# EAGLE design pixpi (EAGLE 9.1.0)

## Sheet 1 of 2: fuse
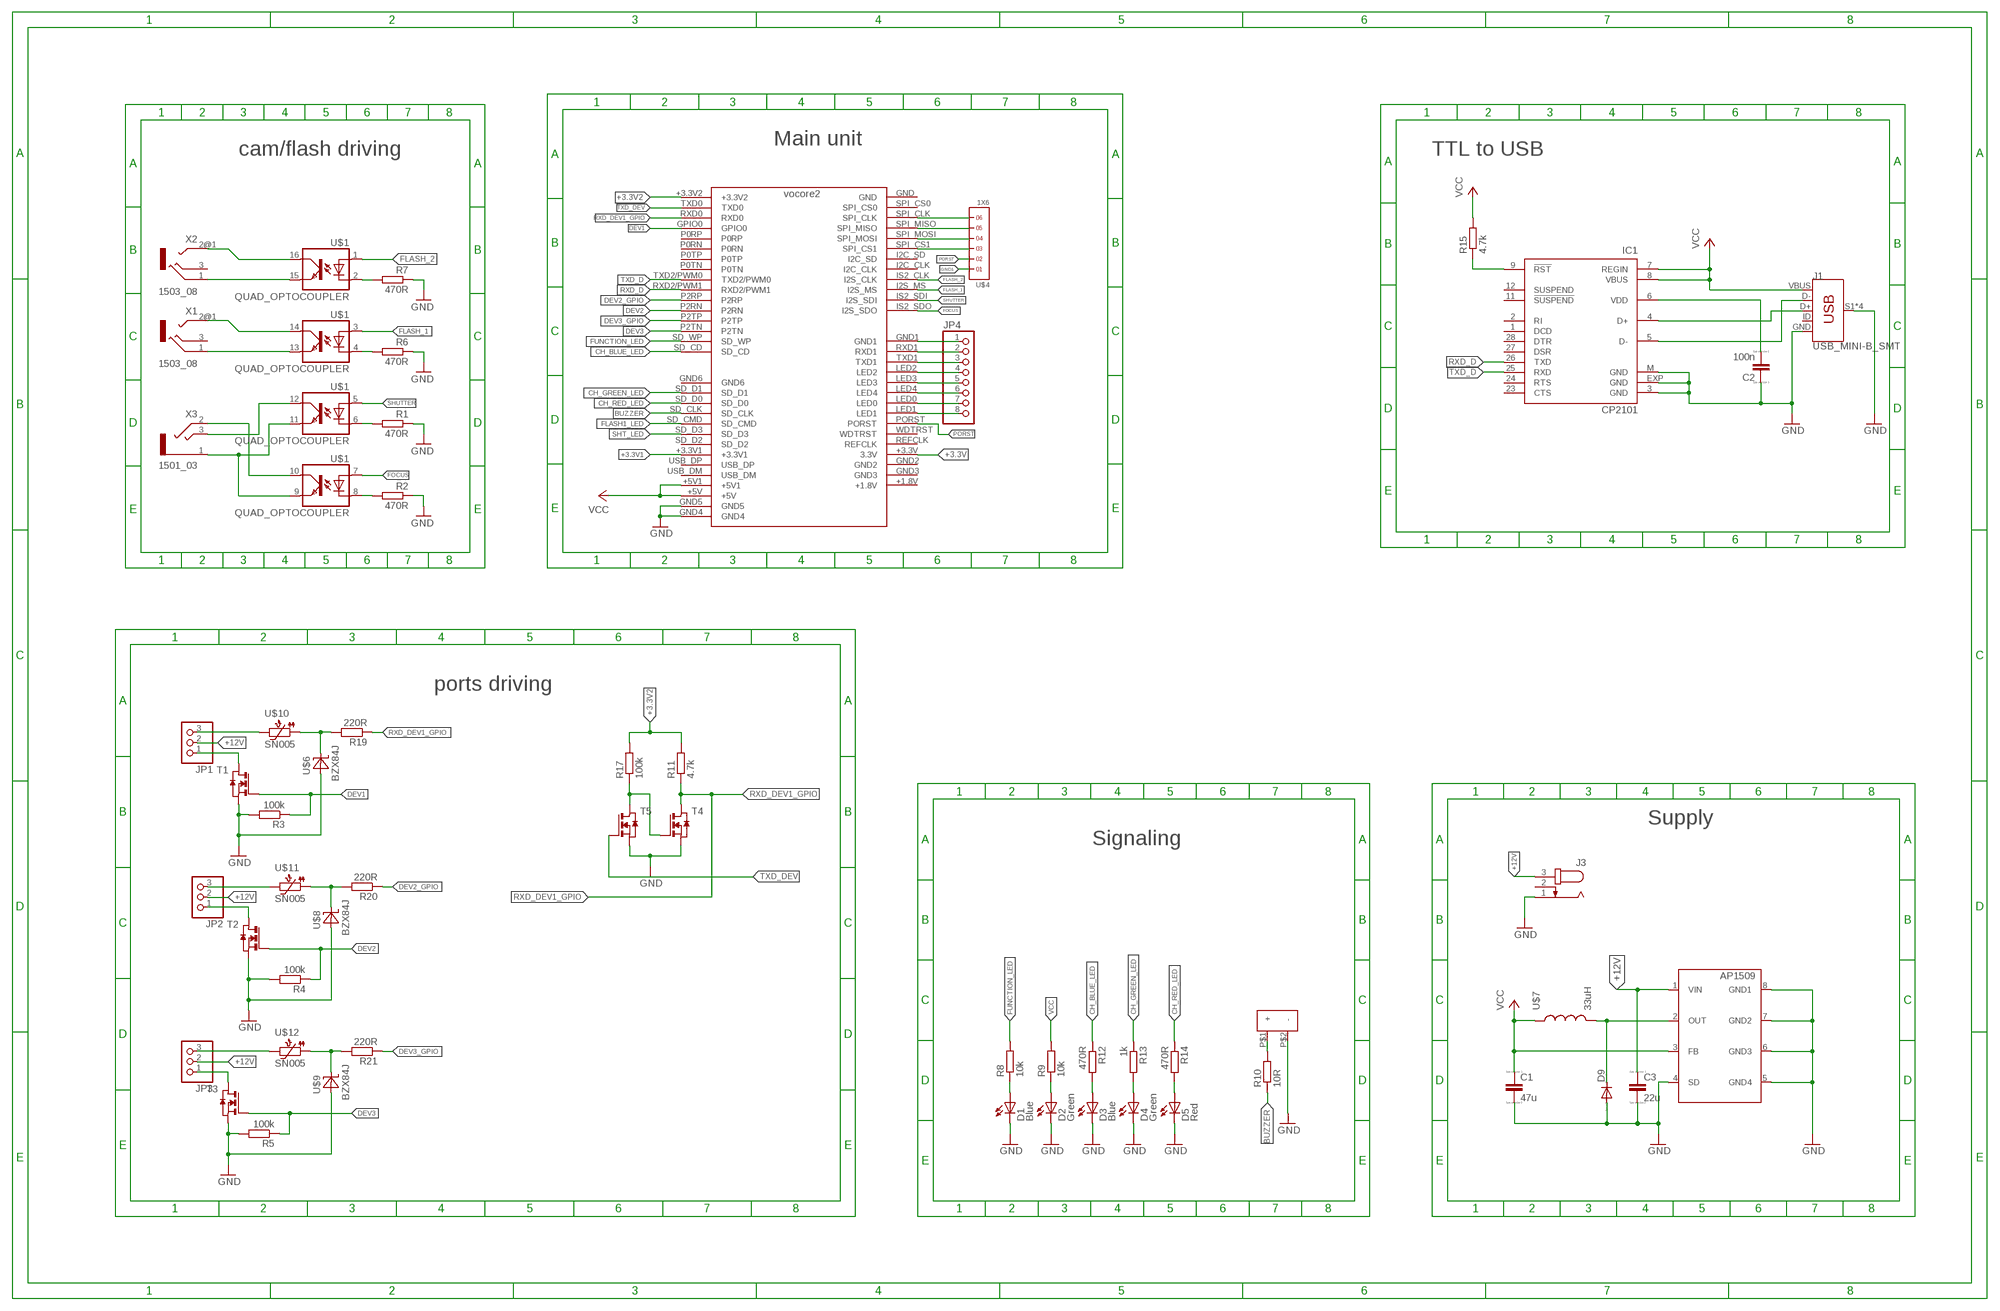
[diagram p0: schematic, sheet 1]

### Parts
C1  47u  CC1210  [C1210]
C2  100n  C  [C0805]
C3  22u  CC1210  [C1210]
D1  Blue  LEDCHIPLED_0603  [CHIPLED_0603]
D2  Green  LEDCHIPLED_0603  [CHIPLED_0603]
D3  Blue  LEDCHIPLED_1206  [CHIPLED_1206]
D4  Green  LEDCHIPLED_1206  [CHIPLED_1206]
D5  Red  LEDCHIPLED_1206  [CHIPLED_1206]
D9  DIODE-SOD323-W  [SOD323-W]
IC1  CP2101  [MLP28]
J1  USB_MINI-B_SMT  [USB-MINIB]
J3  JACK-PLUG0  [SPC4077]
JP1  PINHD-1X3/90  [1X03/90]
JP2  PINHD-1X3/90  [1X03/90]
JP3  PINHD-1X3/90  [1X03/90]
JP4  PINHD-1X8  [1X08]
R1  470R  R-EU_R0805  [R0805]
R2  470R  R-EU_R0805  [R0805]
R3  100k  R-EU_R0805  [R0805]
R4  100k  R-EU_R0805  [R0805]
R5  100k  R-EU_R0805  [R0805]
R6  470R  R-EU_R0805  [R0805]
R7  470R  R-EU_R0805  [R0805]
R8  10k  R-EU_R0805  [R0805]
R9  10k  R-EU_R0805  [R0805]
R10  10R  R-EU_R0805  [R0805]
R11  4.7k  R-EU_R0805  [R0805]
R12  470R  R-EU_R0805  [R0805]
R13  1k  R-EU_R0805  [R0805]
R14  470R  R-EU_R0805  [R0805]
R15  4.7k  R-EU_R0805  [R0805]
R17  100k  R-EU_R0805  [R0805]
R19  220R  R-EU_R0805  [R0805]
R20  220R  R-EU_R0805  [R0805]
R21  220R  R-EU_R0805  [R0805]
T1  NMOSSOT23  [SOT-23]
T2  NMOSSOT23  [SOT-23]
T3  NMOSSOT23  [SOT-23]
T4  NMOSSOT23  [SOT-23]
T5  NMOSSOT23  [SOT-23]
U$1  QUAD_OPTOCOUPLER  [SO16]
U$2  VOCORE2  [VOCORE2]
U$3  LD-BZEG-0905  [LD-BZEG-0905]
U$4  1X6  [1X6]
U$5  AP1509  [SOP08]
U$6  BZX84J  [SOD323_ST]
U$7  33uH  DJNR6028  [DJNR6028]
U$8  BZX84J  [SOD323_ST]
U$9  BZX84J  [SOD323_ST]
U$10  SN005  [R1206]
U$11  SN005  [R1206]
U$12  SN005  [R1206]
X1  1503_08  [1503_08]
X2  1503_08  [1503_08]
X3  1501_03  [1501_03]

### Nets
+3.3V: U$2.+3.3V(3.3V)
+3.3V1: U$2.+3.3V1
+3.3V2: R11.2 R17.2 U$2.+3.3V2
+12V: C3.1 J3.3 JP1.2 JP2.2 JP3.2 U$5.1(VIN)
BUZZER: R10.1 U$2.SD_CLK
CH_BLUE_LED: R12.1 U$2.SD_CD
CH_GREEN_LED: R13.1 U$2.SD_D1
CH_RED_LED: R14.1 U$2.SD_D0
DEV1: R3.1 T1.3(G) U$2.GPIO0
DEV2: R4.1 T2.3(G) U$2.P2RN
DEV2_GPIO: R20.1 U$2.P2RP
DEV3: R5.1 T3.3(G) U$2.P2TN
DEV3_GPIO: R21.1 U$2.P2TP
FLASH1_LED: U$2.SD_CMD
FLASH_1: U$1.3(A1) U$2.I2S_MS
FLASH_2: U$1.1(A) U$2.IS2_CLK(I2S_CLK)
FOCUS: U$1.7(A3) U$2.IS2_SDO(I2S_SDO)
FUNCTION_LED: R8.2 U$2.SD_WP
GND: C1.2 C2.1 C3.2 D1.C D2.C D3.C D4.C D5.C D9.A IC1.3(GND) IC1.EXP(GND) IC1.M(GND) J1.GND J1.S1(SHIELD) J1.S2(SHIELD) J1.S3(SHIELD) J1.S4(SHIELD) J3.1 R1.1 R2.1 R3.2 R4.2 R5.2 R6.1 R7.1 T1.2(S) T2.2(S) T3.2(S) T4.2(S) T5.2(S) U$2.GND4 U$2.GND5 U$3.P$2(-) U$5.4(SD) U$5.5(GND4) U$5.6(GND3) U$5.7(GND2) U$5.8(GND1) U$6.A U$8.A U$9.A
GND1: JP4.1 U$2.GND1 U$4.1
N$1: JP2.1 T2.1(D)
N$2: R19.2 U$6.C U$10.1
N$3: D9.C U$5.2(OUT) U$7.P$4
N$4: U$1.13(EMIT1) X1.1
N$5: U$1.10(COL3) X3.2
N$6: JP1.3 U$10.2
N$7: R6.2 U$1.4(C1)
N$8: JP3.1 T3.1(D)
N$9: R21.2 U$9.C U$12.1
N$10: U$1.12(COL2) X3.3
N$11: U$1.9(EMIT3) U$1.11(EMIT2) X3.1
N$12: R1.2 U$1.6(C2)
N$13: R10.2 U$3.P$1(+)
N$14: R2.2 U$1.8(C3)
N$15: JP2.3 U$11.2
N$16: U$1.14(COL1) X1.2@1
N$17: JP3.3 U$12.2
N$18: D2.A R9.1
N$19: D1.A R8.1
N$20: R20.2 U$8.C U$11.1
N$21: JP1.1 T1.1(D)
N$22: IC1.9(!RST) R15.1
N$23: U$2.SPI_CS1 U$4.3
N$24: IC1.5(D-) J1.D-
N$25: IC1.4(D+) J1.D+
N$26: C2.2 IC1.6(VDD)
N$27: U$2.SPI_MOSI U$4.4
N$28: U$2.SPI_MISO U$4.5
N$29: U$2.SPI_CLK U$4.6
N$35: R17.1 T4.3(G) T5.1(D)
N$43: D3.A R12.2
N$44: D4.A R13.2
N$45: U$1.15(EMIT) X2.1
N$46: U$1.16(COL) X2.2@1
N$47: D5.A R14.2
N$48: R7.2 U$1.2(C)
N$53: JP4.2 U$2.RXD1
N$54: JP4.3 U$2.TXD1
N$55: JP4.4 U$2.LED2
N$56: JP4.5 U$2.LED3
N$57: JP4.6 U$2.LED4
N$58: JP4.7 U$2.LED0
N$59: JP4.8 U$2.LED1
PORST: U$2.PORST U$4.2
RXD_D: IC1.26(TXD) U$2.RXD2/PWM1
RXD_DEV1_GPIO: R11.1 R19.1 T4.1(D) U$2.RXD0
SHT_LED: U$2.SD_D3
SHUTTER: U$1.5(A2) U$2.IS2_SDI(I2S_SDI)
TXD_D: IC1.25(RXD) U$2.TXD2/PWM0
TXD_DEV: T5.3(G) U$2.TXD0
VCC: C1.1 IC1.7(REGIN) IC1.8(VBUS) J1.VBUS R9.2 R15.2 U$2.+5V U$2.+5V1 U$5.3(FB) U$7.P$3
Unconnected: IC1.1(DCD) IC1.2(RI) IC1.11(!SUSPEND) IC1.12(SUSPEND) IC1.23(CTS) IC1.24(RTS) IC1.27(DSR) IC1.28(DTR) J1.ID J3.2 U$2.+1.8V U$2.GND U$2.GND2 U$2.GND3 U$2.GND6 U$2.I2C_CLK U$2.I2C_SD U$2.P0RN U$2.P0RP U$2.P0TN U$2.P0TP U$2.REFCLK U$2.SD_D2 U$2.SPI_CS0 U$2.USB_DM U$2.USB_DP U$2.WDTRST X1.2@2 X1.3 X2.2@2 X2.3

### Notes on the sheet
- Main unit
- cam/flash driving | TTL to USB
- ports driving
- Supply
- Signaling

## Sheet 2 of 2

## Library data of the parts
C1-C3 = eagle-ltspice:C: CAPACITOR, European symbol; SPICEMODEL: NONE; SPICEPREFIX: C
D1 = led:LED: LED OSRAM: - CHIPLED LG R971, LG N971, LY N971, LG Q971, LY Q971, LO R971, LY R971 LH N974, LH R974 LS Q976, LO Q976, LY Q976 LO Q996 - Hyper CHIPLED LW Q18S LB Q993, LB Q99A, LB R99A - SideLED LS A670, LO A670, LY A670, LG A670, LP A670 LB A673, LV A673, LT A673, LW A673 LH A674 LY A675 LS A676, LA A676, LO A676, LY A676, LW A676 LS A679, LY A679, LG A679 - Hyper Micro SIDELED® LS Y876, LA Y876, LO Y876, LY Y876 LT Y87S - SmartLED LW L88C, LW L88S LB L89C, LB L89S, LG L890 LS L89K, LO L89K, LY L89K LS L896, LA L896, LO L896, LY L896 - TOPLED LS T670, LO T670, LY T670, LG T670, LP T670 LSG T670, LSP T670, LSY T670, LOP T670, LYG T670 LG T671, LOG T671, LSG T671 LB T673, LV T673, LT T673, LW T673 LH T674 LS T676, LA T676, LO T676, LY T676, LB T676, LH T676, LSB T676, LW T676 LB T67C, LV T67C, LT T67C, LS T67K, LO T67K, LY T67K, LW E67C LS E67B, LA E67B, LO E67B, LY E67B, LB E67C, LV E67C, LT E67C LW T67C LS T679, LY T679, LG T679 LS T770, LO T770, LY T770, LG T770, LP T770 LB T773, LV T773, LT T773, LW T773 LH T774 LS E675, LA E675, LY E675, LS T675 LS T776, LA T776, LO T776, LY T776, LB T776 LHGB T686 LT T68C, LB T68C - Hyper Mini TOPLED® LB M676 - Mini TOPLED Santana® LG M470 LS M47K, LO M47K, LY M47K Source: http://www.osram.convergy.de LUXEON: - LUMILED® LXK2-PW12-R00, LXK2-PW12-S00, LXK2-PW14-U00, LXK2-PW14-V00 LXK2-PM12-R00, LXK2-PM12-S00, LXK2-PM14-U00 LXK2-PE12-Q00, LXK2-PE12-R00, LXK2-PE12-S00, LXK2-PE14-T00, LXK2-PE14-U00 LXK2-PB12-K00, LXK2-PB12-L00, LXK2-PB12-M00, LXK2-PB14-N00, LXK2-PB14-P00, LXK2-PB14-Q00 LXK2-PR12-L00, LXK2-PR12-M00, LXK2-PR14-Q00, LXK2-PR14-R00 LXK2-PD12-Q00, LXK2-PD12-R00, LXK2-PD12-S00 LXK2-PH12-R00, LXK2-PH12-S00 LXK2-PL12-P00, LXK2-PL12-Q00, LXK2-PL12-R00 Source: www.luxeon.com KINGBRIGHT: KA-3528ASYC Source: www.kingbright.com; SPICEPREFIX: D; TME: FYLS-0603UBC
D2 = led:LED: LED OSRAM: - CHIPLED LG R971, LG N971, LY N971, LG Q971, LY Q971, LO R971, LY R971 LH N974, LH R974 LS Q976, LO Q976, LY Q976 LO Q996 - Hyper CHIPLED LW Q18S LB Q993, LB Q99A, LB R99A - SideLED LS A670, LO A670, LY A670, LG A670, LP A670 LB A673, LV A673, LT A673, LW A673 LH A674 LY A675 LS A676, LA A676, LO A676, LY A676, LW A676 LS A679, LY A679, LG A679 - Hyper Micro SIDELED® LS Y876, LA Y876, LO Y876, LY Y876 LT Y87S - SmartLED LW L88C, LW L88S LB L89C, LB L89S, LG L890 LS L89K, LO L89K, LY L89K LS L896, LA L896, LO L896, LY L896 - TOPLED LS T670, LO T670, LY T670, LG T670, LP T670 LSG T670, LSP T670, LSY T670, LOP T670, LYG T670 LG T671, LOG T671, LSG T671 LB T673, LV T673, LT T673, LW T673 LH T674 LS T676, LA T676, LO T676, LY T676, LB T676, LH T676, LSB T676, LW T676 LB T67C, LV T67C, LT T67C, LS T67K, LO T67K, LY T67K, LW E67C LS E67B, LA E67B, LO E67B, LY E67B, LB E67C, LV E67C, LT E67C LW T67C LS T679, LY T679, LG T679 LS T770, LO T770, LY T770, LG T770, LP T770 LB T773, LV T773, LT T773, LW T773 LH T774 LS E675, LA E675, LY E675, LS T675 LS T776, LA T776, LO T776, LY T776, LB T776 LHGB T686 LT T68C, LB T68C - Hyper Mini TOPLED® LB M676 - Mini TOPLED Santana® LG M470 LS M47K, LO M47K, LY M47K Source: http://www.osram.convergy.de LUXEON: - LUMILED® LXK2-PW12-R00, LXK2-PW12-S00, LXK2-PW14-U00, LXK2-PW14-V00 LXK2-PM12-R00, LXK2-PM12-S00, LXK2-PM14-U00 LXK2-PE12-Q00, LXK2-PE12-R00, LXK2-PE12-S00, LXK2-PE14-T00, LXK2-PE14-U00 LXK2-PB12-K00, LXK2-PB12-L00, LXK2-PB12-M00, LXK2-PB14-N00, LXK2-PB14-P00, LXK2-PB14-Q00 LXK2-PR12-L00, LXK2-PR12-M00, LXK2-PR14-Q00, LXK2-PR14-R00 LXK2-PD12-Q00, LXK2-PD12-R00, LXK2-PD12-S00 LXK2-PH12-R00, LXK2-PH12-S00 LXK2-PL12-P00, LXK2-PL12-Q00, LXK2-PL12-R00 Source: www.luxeon.com KINGBRIGHT: KA-3528ASYC Source: www.kingbright.com; TME: CL-197HG5-CF
D3 = led:LED: LED OSRAM: - CHIPLED LG R971, LG N971, LY N971, LG Q971, LY Q971, LO R971, LY R971 LH N974, LH R974 LS Q976, LO Q976, LY Q976 LO Q996 - Hyper CHIPLED LW Q18S LB Q993, LB Q99A, LB R99A - SideLED LS A670, LO A670, LY A670, LG A670, LP A670 LB A673, LV A673, LT A673, LW A673 LH A674 LY A675 LS A676, LA A676, LO A676, LY A676, LW A676 LS A679, LY A679, LG A679 - Hyper Micro SIDELED® LS Y876, LA Y876, LO Y876, LY Y876 LT Y87S - SmartLED LW L88C, LW L88S LB L89C, LB L89S, LG L890 LS L89K, LO L89K, LY L89K LS L896, LA L896, LO L896, LY L896 - TOPLED LS T670, LO T670, LY T670, LG T670, LP T670 LSG T670, LSP T670, LSY T670, LOP T670, LYG T670 LG T671, LOG T671, LSG T671 LB T673, LV T673, LT T673, LW T673 LH T674 LS T676, LA T676, LO T676, LY T676, LB T676, LH T676, LSB T676, LW T676 LB T67C, LV T67C, LT T67C, LS T67K, LO T67K, LY T67K, LW E67C LS E67B, LA E67B, LO E67B, LY E67B, LB E67C, LV E67C, LT E67C LW T67C LS T679, LY T679, LG T679 LS T770, LO T770, LY T770, LG T770, LP T770 LB T773, LV T773, LT T773, LW T773 LH T774 LS E675, LA E675, LY E675, LS T675 LS T776, LA T776, LO T776, LY T776, LB T776 LHGB T686 LT T68C, LB T68C - Hyper Mini TOPLED® LB M676 - Mini TOPLED Santana® LG M470 LS M47K, LO M47K, LY M47K Source: http://www.osram.convergy.de LUXEON: - LUMILED® LXK2-PW12-R00, LXK2-PW12-S00, LXK2-PW14-U00, LXK2-PW14-V00 LXK2-PM12-R00, LXK2-PM12-S00, LXK2-PM14-U00 LXK2-PE12-Q00, LXK2-PE12-R00, LXK2-PE12-S00, LXK2-PE14-T00, LXK2-PE14-U00 LXK2-PB12-K00, LXK2-PB12-L00, LXK2-PB12-M00, LXK2-PB14-N00, LXK2-PB14-P00, LXK2-PB14-Q00 LXK2-PR12-L00, LXK2-PR12-M00, LXK2-PR14-Q00, LXK2-PR14-R00 LXK2-PD12-Q00, LXK2-PD12-R00, LXK2-PD12-S00 LXK2-PH12-R00, LXK2-PH12-S00 LXK2-PL12-P00, LXK2-PL12-Q00, LXK2-PL12-R00 Source: www.luxeon.com KINGBRIGHT: KA-3528ASYC Source: www.kingbright.com; TME: FYLS-1206UBC
D4 = led:LED: LED OSRAM: - CHIPLED LG R971, LG N971, LY N971, LG Q971, LY Q971, LO R971, LY R971 LH N974, LH R974 LS Q976, LO Q976, LY Q976 LO Q996 - Hyper CHIPLED LW Q18S LB Q993, LB Q99A, LB R99A - SideLED LS A670, LO A670, LY A670, LG A670, LP A670 LB A673, LV A673, LT A673, LW A673 LH A674 LY A675 LS A676, LA A676, LO A676, LY A676, LW A676 LS A679, LY A679, LG A679 - Hyper Micro SIDELED® LS Y876, LA Y876, LO Y876, LY Y876 LT Y87S - SmartLED LW L88C, LW L88S LB L89C, LB L89S, LG L890 LS L89K, LO L89K, LY L89K LS L896, LA L896, LO L896, LY L896 - TOPLED LS T670, LO T670, LY T670, LG T670, LP T670 LSG T670, LSP T670, LSY T670, LOP T670, LYG T670 LG T671, LOG T671, LSG T671 LB T673, LV T673, LT T673, LW T673 LH T674 LS T676, LA T676, LO T676, LY T676, LB T676, LH T676, LSB T676, LW T676 LB T67C, LV T67C, LT T67C, LS T67K, LO T67K, LY T67K, LW E67C LS E67B, LA E67B, LO E67B, LY E67B, LB E67C, LV E67C, LT E67C LW T67C LS T679, LY T679, LG T679 LS T770, LO T770, LY T770, LG T770, LP T770 LB T773, LV T773, LT T773, LW T773 LH T774 LS E675, LA E675, LY E675, LS T675 LS T776, LA T776, LO T776, LY T776, LB T776 LHGB T686 LT T68C, LB T68C - Hyper Mini TOPLED® LB M676 - Mini TOPLED Santana® LG M470 LS M47K, LO M47K, LY M47K Source: http://www.osram.convergy.de LUXEON: - LUMILED® LXK2-PW12-R00, LXK2-PW12-S00, LXK2-PW14-U00, LXK2-PW14-V00 LXK2-PM12-R00, LXK2-PM12-S00, LXK2-PM14-U00 LXK2-PE12-Q00, LXK2-PE12-R00, LXK2-PE12-S00, LXK2-PE14-T00, LXK2-PE14-U00 LXK2-PB12-K00, LXK2-PB12-L00, LXK2-PB12-M00, LXK2-PB14-N00, LXK2-PB14-P00, LXK2-PB14-Q00 LXK2-PR12-L00, LXK2-PR12-M00, LXK2-PR14-Q00, LXK2-PR14-R00 LXK2-PD12-Q00, LXK2-PD12-R00, LXK2-PD12-S00 LXK2-PH12-R00, LXK2-PH12-S00 LXK2-PL12-P00, LXK2-PL12-Q00, LXK2-PL12-R00 Source: www.luxeon.com KINGBRIGHT: KA-3528ASYC Source: www.kingbright.com; TME: FYLS-1206PGC
D5 = led:LED: LED OSRAM: - CHIPLED LG R971, LG N971, LY N971, LG Q971, LY Q971, LO R971, LY R971 LH N974, LH R974 LS Q976, LO Q976, LY Q976 LO Q996 - Hyper CHIPLED LW Q18S LB Q993, LB Q99A, LB R99A - SideLED LS A670, LO A670, LY A670, LG A670, LP A670 LB A673, LV A673, LT A673, LW A673 LH A674 LY A675 LS A676, LA A676, LO A676, LY A676, LW A676 LS A679, LY A679, LG A679 - Hyper Micro SIDELED® LS Y876, LA Y876, LO Y876, LY Y876 LT Y87S - SmartLED LW L88C, LW L88S LB L89C, LB L89S, LG L890 LS L89K, LO L89K, LY L89K LS L896, LA L896, LO L896, LY L896 - TOPLED LS T670, LO T670, LY T670, LG T670, LP T670 LSG T670, LSP T670, LSY T670, LOP T670, LYG T670 LG T671, LOG T671, LSG T671 LB T673, LV T673, LT T673, LW T673 LH T674 LS T676, LA T676, LO T676, LY T676, LB T676, LH T676, LSB T676, LW T676 LB T67C, LV T67C, LT T67C, LS T67K, LO T67K, LY T67K, LW E67C LS E67B, LA E67B, LO E67B, LY E67B, LB E67C, LV E67C, LT E67C LW T67C LS T679, LY T679, LG T679 LS T770, LO T770, LY T770, LG T770, LP T770 LB T773, LV T773, LT T773, LW T773 LH T774 LS E675, LA E675, LY E675, LS T675 LS T776, LA T776, LO T776, LY T776, LB T776 LHGB T686 LT T68C, LB T68C - Hyper Mini TOPLED® LB M676 - Mini TOPLED Santana® LG M470 LS M47K, LO M47K, LY M47K Source: http://www.osram.convergy.de LUXEON: - LUMILED® LXK2-PW12-R00, LXK2-PW12-S00, LXK2-PW14-U00, LXK2-PW14-V00 LXK2-PM12-R00, LXK2-PM12-S00, LXK2-PM14-U00 LXK2-PE12-Q00, LXK2-PE12-R00, LXK2-PE12-S00, LXK2-PE14-T00, LXK2-PE14-U00 LXK2-PB12-K00, LXK2-PB12-L00, LXK2-PB12-M00, LXK2-PB14-N00, LXK2-PB14-P00, LXK2-PB14-Q00 LXK2-PR12-L00, LXK2-PR12-M00, LXK2-PR14-Q00, LXK2-PR14-R00 LXK2-PD12-Q00, LXK2-PD12-R00, LXK2-PD12-S00 LXK2-PH12-R00, LXK2-PH12-S00 LXK2-PL12-P00, LXK2-PL12-Q00, LXK2-PL12-R00 Source: www.luxeon.com KINGBRIGHT: KA-3528ASYC Source: www.kingbright.com; TME: FYLS-1206URC
D9 = diode:DIODE-: DIODE; TME: BAS3010A03WE6327HTSA1
IC1 = silabs:CP210*: Single-Chip USB to UART Bridge Source: www.silabs.com .. CP2101.pdf / cp2102.pdf; MF: FARNELL; MPN: CP2102-GM; OC_FARNELL: 9282130; OC_NEWARK: 30K5635
J1 = SparkFun-Connectors:USB_MINI-B: USB type Mini-B Connector Breaks out 5th pin, and includes shield pins if needed. SparkFun Products: SparkFun FTDI Basic Breakout <https://www.sparkfun.com/products/9716> SparkFun XBee Explorer USB <https://www.sparkfun.com/products/11812> SparkFun Redboard <https://www.sparkfun.com/products/12757>; PROD_ID: CONN-08193; SF_ID: PRT-00587
J3 = con-jack:JACK-PLUG: DC POWER JACK Power Jack, DC, Right Angle, Through Hole, Rated 5A at 16VDC, PC Terminals Distributor: Farnell (www.Farnell.de) Drawing: 84N1161.pdf / 84N1162.pdf Manufacturer: SPC Technology (www.spctechnology.com) Type: SPC4077 / SPC 4078; OC_FARNELL: unknown; OC_NEWARK: unknown; TME: NINIGI PC-GK2.1
JP1-JP3 = pinhead:PINHD-1X3: PIN HEADER; TME: FCI 76382-303LF
JP4 = pinhead:PINHD-1X8: PIN HEADER
R1-R15 R17 R19-R21 = rcl:R-EU_: RESISTOR, European symbol; SPICEPREFIX: R
T1-T3 = zetex:NMOSSOT23: MOS FET; OC_FARNELL: unknown; OC_NEWARK: unknown; TME: TSM2312CX
T4 T5 = zetex:NMOSSOT23: MOS FET; OC_FARNELL: unknown; OC_NEWARK: unknown; TME: 2N7002
U$1 = my_mixed:QUAD_OPTOCOUPLER; TME: TCMT4100
U$2 = vocore2:VOCORE2
U$3 = buzzer-LD-BZEG-0905:LD-BZEG-0905; TME: LD-BZEG-0905
U$4 = headers(.05in):1X6
U$5 = AP1509:AP1509
U$6 U$8 U$9 = sod323Zener:BZX84J; TME: BZX84J-B3V6.115
U$7 = djnr6028:DJNR6028
U$10-U$12 = ptcfuse:SN005; TME: ECE SN005-60
X1 = con-lumberg:1503_?: Jack connectors according to JISC 6560, 3.5 mm Klinkensteckverbinder nach JISC 6560, 3,5 mm Source: http://www.lumberg.com/Produkte/PDFs/1503_08.pdf; OC_FARNELL: unknown; OC_NEWARK: unknown
X2 = con-lumberg:1503_?: Jack connectors according to JISC 6560, 3.5 mm Klinkensteckverbinder nach JISC 6560, 3,5 mm Source: http://www.lumberg.com/Produkte/PDFs/1503_08.pdf; OC_FARNELL: unknown; OC_NEWARK: unknown; TME: LUMBERG 1503 08
X3 = con-lumberg:1501_03: Klinkensteckverbinder nach JISC 6560, 2,5 mm Jack connectors according to JISC 6560, 2.5 mm Source: http://www.lumberg.com/Produkte/PDFs/1501_03.pdf; OC_FARNELL: 1200127; OC_NEWARK: unknown; TME: 1501-03

## Board
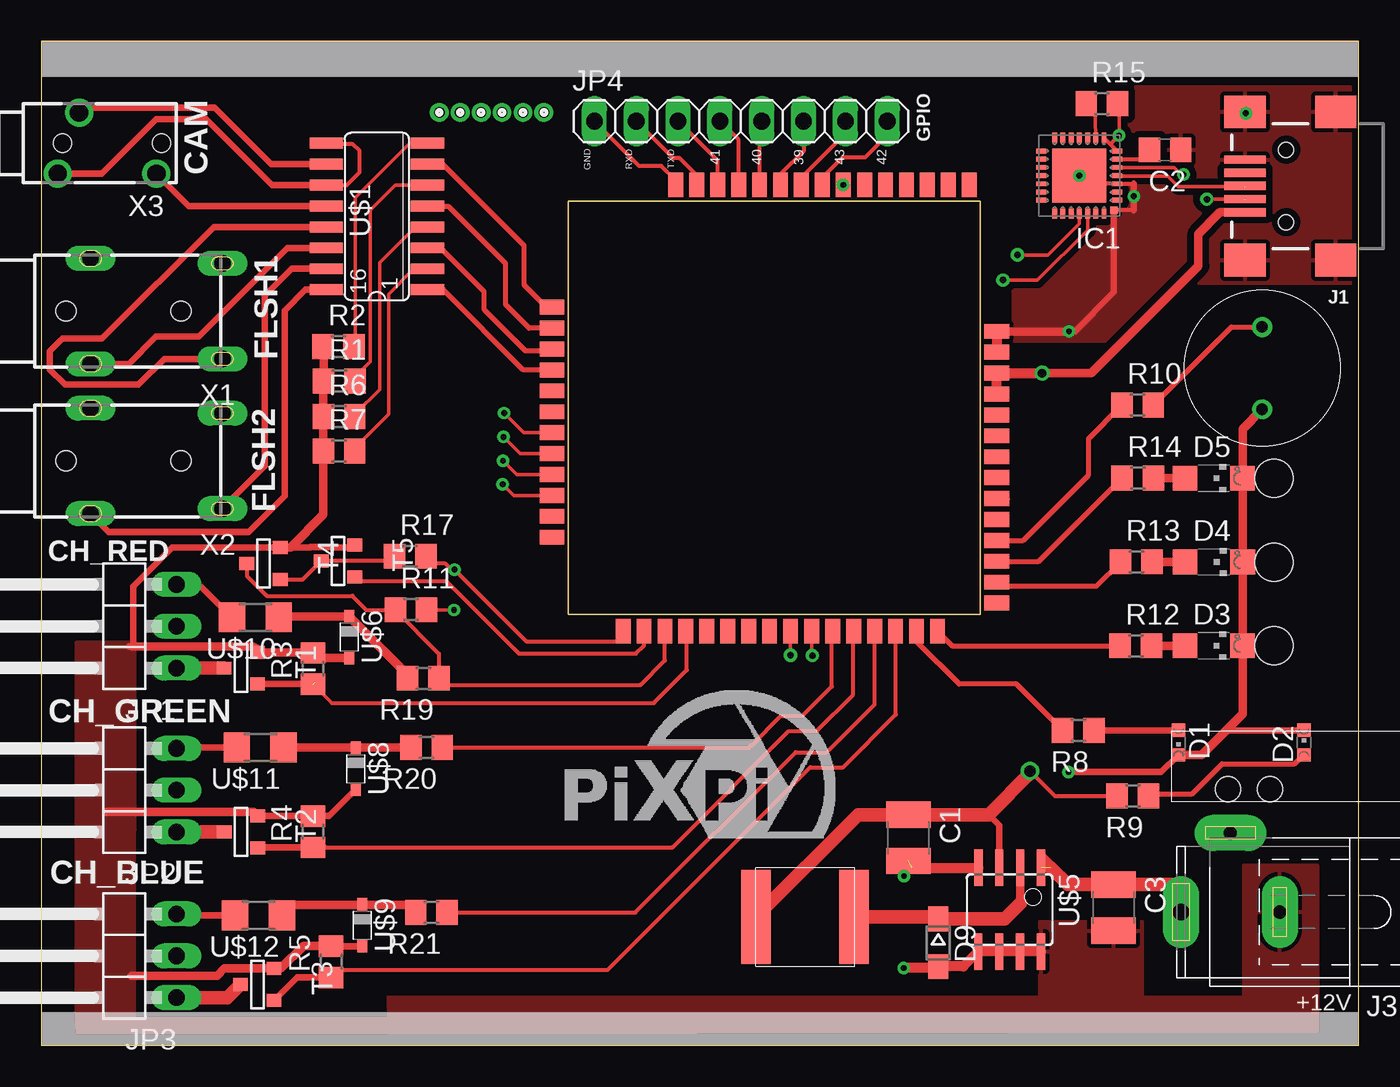
[diagram p1: board, top side]
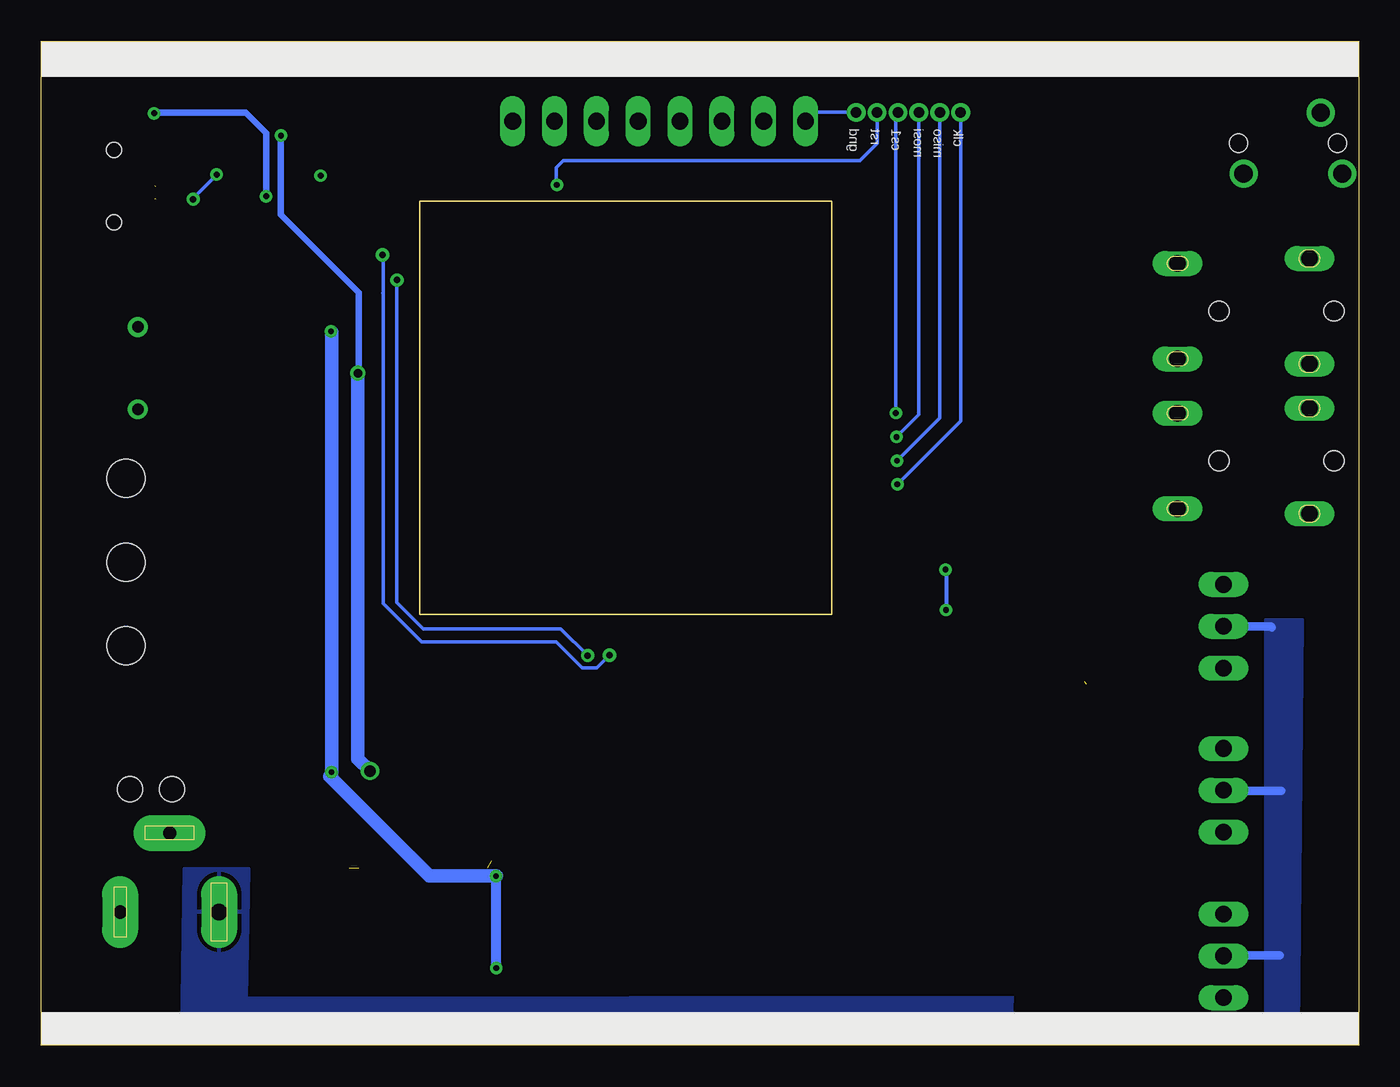
[diagram p2: board, bottom side, seen from below]

Size 80 x 61 mm. Coordinates in mm from the lower left corner, seen from the top.
Outline: 0,0 80,0 80,61 0,61 0,0
Copper layers (1*16): Top 0.035mm / dielectric 1.5mm / Bottom 0.035mm
Design rules "default *": minimum track width 6mil, minimum drill 0.35mm, track to track 6mil, track to pad 6mil, pad to pad 6mil, via to via 6mil, smd to smd 6mil, copper to edge 8mil, drill to drill 2mil, minimum pad ring 10mil, minimum via ring 8mil, stop-mask expansion 4mil, vias tented up to drill 0mil, thermal gap 10mil
Holes 1.5 mm at 72.06,15.56 74.6,15.56
Holes 2.3 mm at 74.85,24.29 74.86,29.34 74.86,34.44

### Footprints (pad centres in the part's own frame; a part is rotated, then mirrored left to right if it is on the bottom)
C1210 = smd 1.6 x 2.7: 1 -1.4,0; 2 1.4,0
C0805 = smd 1.3 x 1.5: 1 -0.95,0; 2 0.95,0
CHIPLED_0603 = smd 0.8 x 0.8: A 0,-0.75; C 0,0.75
CHIPLED_1206 = smd 1.5 x 1.5: A 0,-1.75; C 0,1.75
SOD323-W = smd 1.5 x 1.2: A 1.45,0; C -1.45,0
MLP28 = smd 0.6 x 0.3: 1 -2.3,1.5; 2 -2.3,1; 3 -2.3,0.5; 4 -2.3,0; 5 -2.3,-0.5; 6 -2.3,-1; 7 -2.3,-1.5; 15 2.3,-1.5; 16 2.3,-1; 17 2.3,-0.5; 18 2.3,0; 19 2.3,0.5; 20 2.3,1; 21 2.3,1.5 | smd 0.3 x 0.6: 8 -1.5,-2.3; 9 -1,-2.3; 10 -0.5,-2.3; 11 0,-2.3; 12 0.5,-2.3; 13 1,-2.3; 14 1.5,-2.3; 22 1.5,2.3; 23 1,2.3; 24 0.5,2.3; 25 0,2.3; 26 -0.5,2.3; 27 -1,2.3; 28 -1.5,2.3 | smd 3.3 x 3.3: EXP 0,0 | smd 0.435 x 0.435: M -2.103,2.103
USB-MINIB = smd 2.5 x 0.5: D+ 2.5,0; D- 2.5,0.8; GND 2.5,-1.6; ID 2.5,-0.8; VBUS 2.5,1.6 | smd 2.5 x 2: S1 -3,4.5; S2 2.5,4.5; S3 -3,-4.5; S4 2.5,-4.5 | hole 0.9: 0,2.2; 0,-2.2
SPC4077 = drill 0.8 pad 2.184 long: 1 -3,0; 2 0,-4.8 | drill 1 pad 2.184 long: 3 3,0
1X03/90 = drill 1.016 long: 1 -2.54,-3.81; 2 0,-3.81; 3 2.54,-3.81
1X08 = drill 1.016 long: 1 -8.89,0; 2 -6.35,0; 3 -3.81,0; 4 -1.27,0; 5 1.27,0; 6 3.81,0; 7 6.35,0; 8 8.89,0
R0805 = smd 1.3 x 1.5: 1 -0.95,0; 2 0.95,0
SOT-23 = smd 0.787 x 0.889: 1 0.025,-1.016; 2 -0.94,1.016; 3 0.991,1.016
SO16 = smd 0.66 x 2.032: 1 -4.445,-3.073; 2 -3.175,-3.073; 3 -1.905,-3.073; 4 -0.635,-3.073; 5 0.635,-3.073; 6 1.905,-3.073; 7 3.175,-3.073; 8 4.445,-3.073; 9 4.445,3.073; 10 3.175,3.073; 11 1.905,3.073; 12 0.635,3.073; 13 -0.635,3.073; 14 -1.905,3.073; 15 -3.175,3.073; 16 -4.445,3.073
VOCORE2 = smd 1.5 x 0.9: +1.8V 25.4,1.67; +3.3V 25.4,5.48; +3.3V2 -1.7,22.68; GND1 25.4,19.48; GND2 25.4,4.21; GND3 25.4,2.94; GPIO0 -1.7,18.87; LED0 25.4,11.86; LED1 25.4,10.59; LED2 25.4,15.67; LED3 25.4,14.4; LED4 25.4,13.13; P0RN -1.7,16.33; P0RP -1.7,17.6; P0TN -1.7,13.79; P0TP -1.7,15.06; P2RN -1.7,8.68; P2RP -1.7,9.95; P2TN -1.7,6.14; P2TP -1.7,7.41; PORST 25.4,9.32; REFCLK 25.4,6.75; RXD0 -1.7,20.14; RXD1 25.4,18.21; RXD2/PWM1 -1.7,11.22; SD_CD -1.7,3.6; SD_WP -1.7,4.87; TXD0 -1.7,21.41; TXD1 25.4,16.94; TXD2/PWM0 -1.7,12.52; WDTRST 25.4,8.02 | smd 0.9 x 1.5: +3.3V1 8.89,0; +5V 13.97,0; +5V1 12.7,0; GND 4,27; GND4 16.51,0; GND5 15.24,0; GND6 0,0; I2C_CLK 12.89,27; I2C_SD 11.62,27; I2S_MS 15.43,27; IS2_CLK 14.16,27; IS2_SDI 16.7,27; IS2_SDO 17.97,27; SD_CLK 3.81,0; SD_CMD 5.08,0; SD_D0 2.54,0; SD_D1 1.27,0; SD_D2 7.62,0; SD_D3 6.35,0; SPI_CLK 6.54,27; SPI_CS0 5.27,27; SPI_CS1 10.35,27; SPI_MISO 7.81,27; SPI_MOSI 9.08,27; USB_DM 11.43,0; USB_DP 10.16,0
LD-BZEG-0905 = drill 0.7: P$1 2.25,0; P$2 7.25,0
1X6 = drill 0.635 pad 1.016: 1 0,0; 2 1.27,0; 3 2.54,0; 4 3.81,0; 5 5.08,0; 6 6.35,0
SOP08 = smd 0.5 x 2.2: 1 -1.905,-2.9; 2 -0.645,-2.9; 3 0.625,-2.9; 4 1.895,-2.9; 5 1.905,2.2; 6 0.635,2.2; 7 -0.635,2.2; 8 -1.905,2.2
SOD323_ST = smd 0.8 x 0.6: A 1.25,0; C -1.25,0
DJNR6028 = smd 1.8 x 5.7: P$3 0,3; P$4 5.95,3
R1206 = smd 1.6 x 1.803: 1 -1.422,0; 2 1.422,0
1503_08 = drill 1 pad 1.2 long: 1 -2.9,-8; 2@1 -3.2,0; 2@2 3.2,0; 3 2.9,-8 | hole 1.2: 0,1.5; 0,-5.5
1501_03 = drill 1.1 pad 1.7: 1 -1.85,0.3; 2 1.85,-1; 3 -1.85,-5.7 | hole 1.1: 0,0; 0,-6

### Placement (x,y rotation side)
C1  52.65,12.61 270 top
C2  68.24,54.4 180 top
C3  65.11,8.37 270 top
D1  69.05,18.4 180 top
D2  76.67,18.4 0 top
D3  71.19,24.28 270 top
D4  71.2,29.36 270 top
D5  71.19,34.45 270 top
D9  54.47,6.24 270 top
IC1  63.03,52.83 180 top
J1  75.59,52.2 180 top
J3  72.2,8.1 180 top
JP1  4.4,25.46 90 top
JP2  4.4,15.5 90 top
JP3  4.4,5.44 90 top
JP4  42.48,56.14 0 top
R1  18.1,40.35 0 top
R2  18.05,42.45 0 top
R3  16.5,22.89 90 top
R4  16.5,12.98 90 top
R5  17.6,5.08 90 top
R6  18.09,38.2 0 top
R7  18.09,36.1 0 top
R8  62.97,19.13 180 top
R9  66.28,15.15 180 top
R10  66.57,38.9 0 top
R11  22.45,26.47 0 top
R12  66.46,24.27 0 top
R13  66.49,29.37 0 top
R14  66.58,34.46 0 top
R15  64.4,57.2 0 top
R17  22.41,29.71 0 top
R19  23.2,22.3 180 top
R20  23.4,18.1 180 top
R21  23.69,8.08 180 top
T1  12.12,22.94 270 top
T2  12.13,12.99 270 top
T3  13.12,3.73 270 top
T4  13.5,29.3 270 top
T5  18.02,29.45 270 top
U$1  20.38,50.35 90 top
U$2  58.01,26.87 90 top
U$3  74.13,45.89 270 top
U$4  30.52,56.67 180 top
U$5  58.8,7.9 180 top
U$6  18.7,24.8 270 top
U$7  43.4,4.8 0 top
U$8  19.1,16.8 270 top
U$9  19.5,7.3 270 top
U$10  13,26 180 top
U$11  13.3,18.1 180 top
U$12  13.2,7.9 180 top
X1  3,44.6 90 top
X2  3,35.5 90 top
X3  1.3,54.8 90 top

### Tracks (layer width: path | path; a pad name or v marks a point on that pad's centre or on a via)
+3.3V2  (via drill 0.35)
  Top 0.203: 23.61,29.97 R17.2 | R11.2 23.42,26.45 v25.06,26.45 | 35.28,25.2 35.33,25.25
  Top 0.254: U$2.+3.3V2 35.33,25.25 | R17.2 23.77,29.3 24.5,29.3 24.89,28.91 v25.09,28.91 29.46,24.54 35.56,24.54 35.33,24.77
  Top 0.406: U$2.+3.3V2 35.33,24.77
  Bottom 0.203: v25.06,26.45 25.08,26.47
  Bottom 0.254: v25.09,28.91 25.06,28.87 v25.06,26.45
+12V  (1 unrouted)
  Top 0.61: 61.3,10.8 61.3,10.9 60.8,11.4
  Top 0.813: J3.3 69.2,9.77 C3.1 62.33,9.77 61.3,10.8
  Bottom 0.508: JP1.2 5.36,25.46 5.3,25.4 | JP3.2 8.19,5.46 4.79,5.46 | JP2.2 8.18,15.47 4.7,15.47
  pour Bottom (isolate 0.254, rank 3): 71.3,10.7 71.45,0.75 3.68,0.8 3.43,25.82 5.64,25.82 5.64,1.61 21.12,1.61 21.03,2.9 67.55,2.83 67.4,10.7
BUZZER
  Top 0.305: 58.54,30.68 U$2.SD_CLK 59.62,30.68 63.59,34.65 63.59,36.87 R10.1
CH_BLUE_LED
  Top 0.305: U$2.SD_CD 55.31,24.27 R12.1
CH_GREEN_LED
  Top 0.305: 58.12,28.03 U$2.SD_D1 58.25,27.9 64.07,27.9 R13.1
CH_RED_LED
  Top 0.305: U$2.SD_D0 60.58,29.41 R14.1
DEV1  (1 unrouted)
  Top 0.2: 13.15,21.94 T1.3
  Top 0.203: R3.1 17.64,20.8 | 39.2,25.11 U$2.GPIO0
  Top 0.254: 16.64,22.07 16.71,22.14 | R3.1 | 39.2,25.11 39.2,22.8 37.2,20.8 17.64,20.8
  Top 0.406: T1.3 R3.1
DEV2
  Top 0.2: T2.3 13.17,12.03 | 16.31,12.03 R4.1
  Top 0.254: 16.31,12.03 16.36,11.98 16.48,12.1 17.2,12.1 | R4.1 38.33,12.03 45.4,19.1 47.1,19.1 49.3,21.3 49.3,25.13 U$2.P2RN
  Top 0.406: 16.31,12.03 13.17,12.03
DEV2_GPIO
  Top 0.254: 47.98,25.78 U$2.P2RP 48,25.1 48,21.8 46.2,20 44.9,20 43.14,18.24 | 43.14,18.24 43,18.1 | R20.1 43,18.1 | 43,18.1 43.14,18.24
DEV3
  Top 0.254: R5.1 18.07,4.6 34.4,4.6 46.7,16.9 48.7,16.9 51.9,20.1 51.9,25.14 U$2.P2TN
  Top 0.406: T3.3 15.53,4.13 R5.1
DEV3_GPIO
  Top 0.254: R21.1 36.08,8.08 45.8,17.8 47.7,17.8 50.6,20.7 U$2.P2TP
  Top 0.406: U$2.P2TP
FLASH1_LED
  Top 0.305: 58.63,31.95 U$2.SD_CMD 58.65,31.95
FLASH_1
  Top 0.254: 23.65,48.64 U$1.3
  Top 0.305: 23.56,48.34 U$1.3 23.88,48.44 | 23.88,48.44 24.13,48.44 | U$2.I2S_MS 30.92,42.2 29.4,42.2 26.9,44.7 26.9,45.8 24.26,48.44 23.88,48.44
FLASH_2
  Top 0.305: U$2.IS2_CLK 29.27,41.03 24.4,45.9 | 23.77,45.9 24.4,45.9 | 23.77,45.9 U$1.1 | 24.4,45.9 23.77,45.9
FOCUS
  Top 0.254: U$1.7 23.51,53.58
  Top 0.305: 23.47,53.54 U$1.7 24.38,53.52 25.65,52.25 | 25.6,52.3 25.65,52.25 | 25.65,52.25 29.3,48.6 29.3,46.2 30.66,44.84 U$2.IS2_SDO
FUNCTION_LED
  Top 0.254: 53.2,25.11 U$2.SD_WP
  Top 0.305: R8.2 59.2,21.95 55.73,21.95 53.2,24.48 53.2,25.11
GND  (via drill 0.35)  (1 unrouted)
  Top 0.254: 66.34,50.73 IC1.M | 66.34,52.33 IC1.3 63.03,52.33 IC1.EXP
  Top 0.305: D2.C
  Top 0.406: D4.C | 71.95,19.14 D2.C | T3.2 14.56,4.67 | 17.58,6.05 R5.2 19.48,6.03 U$9.A | 16.79,23.55 arc-90 R3.2 arc90 16.46,23.88 | 12.9,14.18 arc-90 T2.2 R4.2 17.48,13.93 U$8.A | 5.31,24.22 5.53,24.22 5.59,24.28 5.59,27.87 7.96,30.24 T4.2 16.33,30.24 16.37,30.28 17.64,30.28 17.68,30.24 18.88,30.24 T5.2 | v62.4,43.37 62.76,43.37 65.13,45.74 IC1.M | 66.34,52.33 v66.34,51.58 66.34,50.73 | v62.37,16.6 68,16.6 D1.C | J1.S4 73.14,56.65 v73.14,56.62
  Top 0.508: D4.C D5.C 72.94,37.45 U$3.P$2 | D4.C D3.C 72.94,20.13 71.95,19.14 70.46,17.65 D1.C | v62.4,43.37 58.02,43.37 | 14.56,4.67 15.94,6.05 17.58,6.05 | 16.79,23.55 U$6.A | 16.46,23.88 T1.2 arc90 12.8,24.22 5.53,24.22 | 12.9,14.18 3.98,14.18 | T4.2 15.14,30.24 17.14,32.24 R7.1 R6.1 17.14,40.34 R1.1 17.15,42.4 R2.1 | T3.2 11.13,4.67 10.68,4.22 5.49,4.22
  Top 0.61: U$5.8 U$5.7 U$5.6 U$5.5 55.98,4.79 D9.A 54.39,4.71 v52.38,4.71 v52.37,4.7 | v52.38,10.29 arc-90 52.89,10.8 U$5.4 | 58.02,43.37 U$2.GND4 U$2.GND5
  Bottom 0.406: v66.34,51.58 66.34,55.42 67.57,56.65 73.11,56.65 v73.14,56.62 73.16,56.62
  Bottom 0.61: v52.37,4.7 v52.37,10.28 v52.38,10.29 | 62.47,16.33 62.37,16.43 v62.37,16.6 | 62.37,43.34 v62.4,43.37
  Bottom 0.813: v52.38,10.29 56.43,10.29 62.47,16.33 | v62.37,16.6 62.37,43.34
  other vias: 63.03,52.83
  pour Top: 73,10.9 73,2.9 21.06,2.9 21.11,1.62 9.95,1.61 5.66,1.61 5.68,24.46 2.14,24.46 2.12,1.55 2.18,0.77 77.5,0.9 77.5,10.9
  pour Top: 60.62,7.5 66.86,7.5 66.86,2.43 60.62,2.43
  pour Top (isolate 0.406): 59.01,58.21 79.72,58.21 79.72,46.3 77.1,46.3 69.82,46.3 66.3,42.78 59.01,42.78
GND1
  Top 0.203: U$2.GND1 38.53,52.55
  Top 0.254: 38.53,52.55 37.66,53.42 36.31,53.42 JP4.1
  Bottom 0.203: U$4.1 33.06,56.67 JP4.1
N$1
  Top 0.508: JP2.1
  Top 0.8: T2.1
  Top 0.813: T2.1 JP2.1
N$2
  Top 0.406: U$10.1 14.87,26.05 | 22.25,22.5 R19.2
  Top 0.508: 14.87,26.05 U$6.C 22.25,22.5
N$3
  Top 0.508: U$5.2 59.45,8.63
  Top 0.61: 54.33,7.83 D9.C
  Top 0.813: 59.45,8.63 58.5,7.69 D9.C 54.36,7.8 U$7.P$4
N$4
  Top 0.406: X1.1 7.47,41.7 5.9,40.13 1.45,40.13 0.53,41.05 0.53,42.17 1.28,42.92 3.68,42.92 10.47,49.71 U$1.13
N$5
  Top 0.305: 17.29,53.54 U$1.10
  Top 0.406: U$1.10 13.97,53.52 10.54,56.95 2.6,56.95 X3.2
N$6
  Top 0.406: U$10.2 9.58,28 JP1.3
N$7
  Top 0.2: R6.2 19.04,38.51
  Top 0.203: 19.44,37.8 R6.2 19.04,38.34 20.55,39.85 20.55,47.56 22.7,49.71 U$1.4
N$8
  Top 0.813: JP3.1 11.3,2.9 T3.1
N$9
  Top 0.406: U$12.1 15.27,8.55 | 22.74,8.55 R21.2
  Top 0.508: 15.27,8.55 U$9.C 22.74,8.55
N$10
  Top 0.305: 17.27,50.94 U$1.12
  Top 0.406: U$1.12 8.97,50.98 X3.3
N$11
  Top 0.254: U$1.11 18.54,52.25 19.33,53.04 19.33,54.34 18.93,54.74 17.36,54.74 U$1.9
  Top 0.305: 17.3,52.24 U$1.11
  Top 0.406: U$1.11 14.03,52.25 10.03,56.25 6.98,56.25 3.69,52.96 X3.1
N$12
  Top 0.2: 19.05,40.67 R1.2 19.05,40.6 19.95,41.49 | 21.73,52.24 21.73,52.25 U$1.6
  Top 0.203: 19.95,41.49 19.99,41.54 19.99,50.72 21.51,52.24 21.73,52.24
N$13
  Top 0.305: R10.2 72.26,43.64 U$3.P$1
N$14
  Top 0.2: 19.29,42.74 R2.2
  Top 0.203: 18.94,42.51 R2.2 19.08,42.53 19.08,51.5 22.37,54.79 U$1.8
N$15
  Top 0.406: U$11.2 8.27,18.1 JP2.3
N$16
  Top 0.254: 17.26,48.39 U$1.14
  Top 0.305: 17.21,48.34 U$1.14 17.21,48.54
  Top 0.406: U$1.14 14.94,48.44 9.56,43.06 6.97,43.06 5.31,41.4 X1.2@1
N$17
  Top 0.406: U$12.2 8.29,7.9 JP3.3
N$18
  Top 0.305: R9.1 67.37,15.29 69.89,15.29 71.7,17.1 76.12,17.1 D2.A
N$19
  Top 0.305: R8.1 63.94,19.15
  Top 0.406: R8.1 69.04,19.13 D1.A
N$20
  Top 0.508: 19.05,18.1 19.95,18.1 R20.2 | 19.05,18.1 U$8.C | U$11.1 18.05,18.1 19.05,18.1
N$21
  Top 0.508: JP1.1
  Top 0.813: JP1.1 T1.1
N$22
  Top 0.203: R15.1 arc-90 64,56.65 64,56.2 arc3 IC1.9
N$23  (via drill 0.35)
  Top 0.203: U$2.SPI_CS1 29.3,37.22 v28.11,38.41
  Bottom 0.203: v28.11,38.41 28.11,56.54 U$4.3
N$24  (via drill 0.35, 0.4)  (1 unrouted)
  Top 0.2: IC1.5 68.79,53.33 | 68.79,53.33 | 68.79,53.33 69.28,52.84 69.28,52.83 v69.34,52.89 | v70.77,51.4 73.03,51.4
  Bottom 0.2: v69.34,52.89 70.77,51.47 v70.77,51.4
N$25  (1 unrouted)
  Top 0.2: IC1.4 65.37,52.79 68.41,52.79 69.04,52.16 73.05,52.16
N$26
  Top 0.254: IC1.6 66.72,53.83 C2.2
N$27  (via drill 0.35)
  Top 0.203: U$2.SPI_MOSI 29.08,35.95 v28.07,36.96
  Bottom 0.203: v28.07,36.96 26.71,38.32 U$4.4
N$28  (via drill 0.35)
  Top 0.203: U$2.SPI_MISO 28.87,34.68 v28.04,35.51
  Bottom 0.203: v28.04,35.51 25.44,38.11 U$4.5
N$29  (via drill 0.35)
  Top 0.203: U$2.SPI_CLK 28.69,33.41 v28.02,34.08
  Bottom 0.203: v28.02,34.08 24.17,37.93 24.17,38.75 U$4.6
N$35
  Top 0.2: 14.51,28.08 T4.3
  Top 0.203: T5.1 17.05,29.48 | R17.1 21.17,29.43
  Top 0.254: T4.3 15.89,28.31 T5.1 21.17,29.43
N$43
  Top 0.508: R12.2 D3.A
N$44
  Top 0.508: R13.2 D4.A
N$45
  Top 0.305: U$1.15 17.28,47.14 17.23,47.19
  Top 0.406: U$1.15 15.21,47.17 13.58,45.54 13.58,35.18 X2.1
N$46
  Top 0.305: 16.69,45.9 U$1.16
  Top 0.406: U$1.16 16.04,45.9 14.78,44.64 14.78,33.37 12.6,31.19 4.11,31.19 X2.2@1
N$47
  Top 0.508: R14.2 D5.A
N$48
  Top 0.2: 19.04,36.37 R7.2 19.04,36.3 20.91,38.17 | 22.53,47.14 22.53,47.17 22.9,47.17 U$1.2
  Top 0.203: 20.91,38.17 21.1,38.36 21.1,45.64 22.63,47.17 22.9,47.17
N$53
  Top 0.203: U$2.RXD1 39.8,52.85
  Top 0.254: 39.8,52.85 38.76,53.89 38.38,53.89 JP4.2
N$54
  Top 0.254: U$2.TXD1 41.07,53.74 JP4.3
N$55
  Top 0.254: U$2.LED2 42.34,55.01 JP4.4
N$56
  Top 0.203: 43.61,56 JP4.5
  Top 0.254: U$2.LED3 43.61,56
N$57
  Top 0.203: U$2.LED4 44.88,52.92 | 46.32,56.11 JP4.6
  Top 0.254: 44.88,52.92 46.32,54.36 46.32,56.11
N$58
  Top 0.203: U$2.LED0 46.15,52.71
  Top 0.254: JP4.7 48.83,55.39 46.15,52.71
N$59
  Top 0.203: U$2.LED1 47.42,52.71 | 51.33,56.1 JP4.8
  Top 0.254: 47.42,52.71 48.66,53.95 50.03,53.95 51.33,55.25 51.33,56.1
PORST  (via drill 0.35)
  Bottom 0.203: U$2.PORST 48.74,52.31 48.74,53.31 48.3,53.75 30.29,53.75 29.25,54.79 U$4.2
  other vias: 48.69,52.27
RXD_D  (via drill 0.4)
  Top 0.203: U$2.RXD2/PWM1 46.79,23.55 v46.82,23.68 | v58.4,46.49 60.49,46.49 63.53,49.53 IC1.26
  Bottom 0.203: v46.82,23.68 48.44,25.3 56.8,25.3 58.4,26.9 | 58.4,26.9 | 58.4,26.9 v58.4,46.49 v58.4,46.5
RXD_DEV1_GPIO
  Top 0.203: 21.5,26.45 R11.1 | 37.9,24.96 37.87,24.98
  Top 0.254: 37.87,24.48 37.94,24.48 | 37.87,24.48 37.87,24.98 U$2.RXD0 | T4.1 12.48,28.52 13.7,27.3 18.9,27.3 19.75,26.45 19.9,26.45 | 19.9,26.45 21.5,26.45 | 37.87,24.48 37.87,23.37 36.4,21.9 24.55,21.9 R19.1 24.15,23.79 21.49,26.45 19.9,26.45
SHT_LED
  Top 0.305: 58.67,33.22 U$2.SD_D3 58.62,33.22
SHUTTER
  Top 0.254: 23.51,51.04 U$1.5
  Top 0.305: 23.73,50.98 U$1.5 | 23.73,50.98 24.39,50.98 | 30.95,43.5 U$2.IS2_SDI 29.63,43.57 28.2,45 28.2,47.5 24.76,50.94 23.78,50.94 23.73,50.98
TXD_D  (via drill 0.4)
  Top 0.203: v45.5,23.7 45.49,23.99 U$2.TXD2/PWM0 | v59.27,48.01 61.11,48.01 63.02,49.92 IC1.25
  Bottom 0.203: v45.5,23.7 46.28,22.92 47.13,22.92 48.71,24.5 56.9,24.5 59.24,26.84 59.24,45.71 | 59.24,45.71 59.25,45.71 | 59.24,45.71 59.24,47.95 59.27,47.98 v59.27,48.01
TXD_DEV
  Top 0.203: 19.34,28.16 T5.3
  Top 0.254: T5.3 19.3,28.2 24.6,28.2 29,23.8 36.1,23.8 36.6,24.3 U$2.TXD0
VCC  (via drill 0.35, 0.5, 0.7)
  Top 0.203: v65.44,55.26 65.44,57.11 R15.2
  Top 0.254: v60.03,16.67 61.55,15.15 R9.2 | IC1.8 64.57,55.09 64.92,54.74 | 64.92,54.74 IC1.7 | v65.44,55.26 v65.43,55.26 64.92,54.74
  Top 0.305: 58.19,10.81 U$5.3 58.09,10.8
  Top 0.406: U$5.3 58.17,13.36 57.52,14.01
  Top 0.508: v60.77,40.83 63.75,40.83 70.26,47.34 70.26,49.29 71.54,50.57 arc-90 71.57,50.6 J1.VBUS
  Top 0.61: U$2.+5V1 U$2.+5V 58.02,40.83 v60.77,40.83 | 60.08,16.57 60.08,16.62 v60.03,16.67
  Top 0.813: U$7.P$3 49.61,14.01 C1.1 57.52,14.01 60.08,16.57
  Bottom 0.254: v60.77,40.83 60.72,40.88
  Bottom 0.406: v65.44,55.26 65.44,50.46 60.72,45.74 60.72,40.88
  Bottom 0.508: 60.07,16.71 v60.03,16.67
  Bottom 0.813: v60.77,40.83 60.77,17.41 v60.03,16.67

### Text on the board
tPlace: GPIO | GND | RXD | TXD | 41 | 40 | 39 | 43 | 42 | CAM | FLSH1 | FLSH2 | CH_RED | CH_GREEN | CH_BLUE | +12V
bPlace: clk | miso | mosi | cs1 | rst | gnd
202bmp: /home/krzysiek/moje/actiontrigger/grafika/logo-pixpi_pcb.bmp